# EAGLE design TMS34010 Adapter for DE10 Nano (EAGLE 7.1.0)
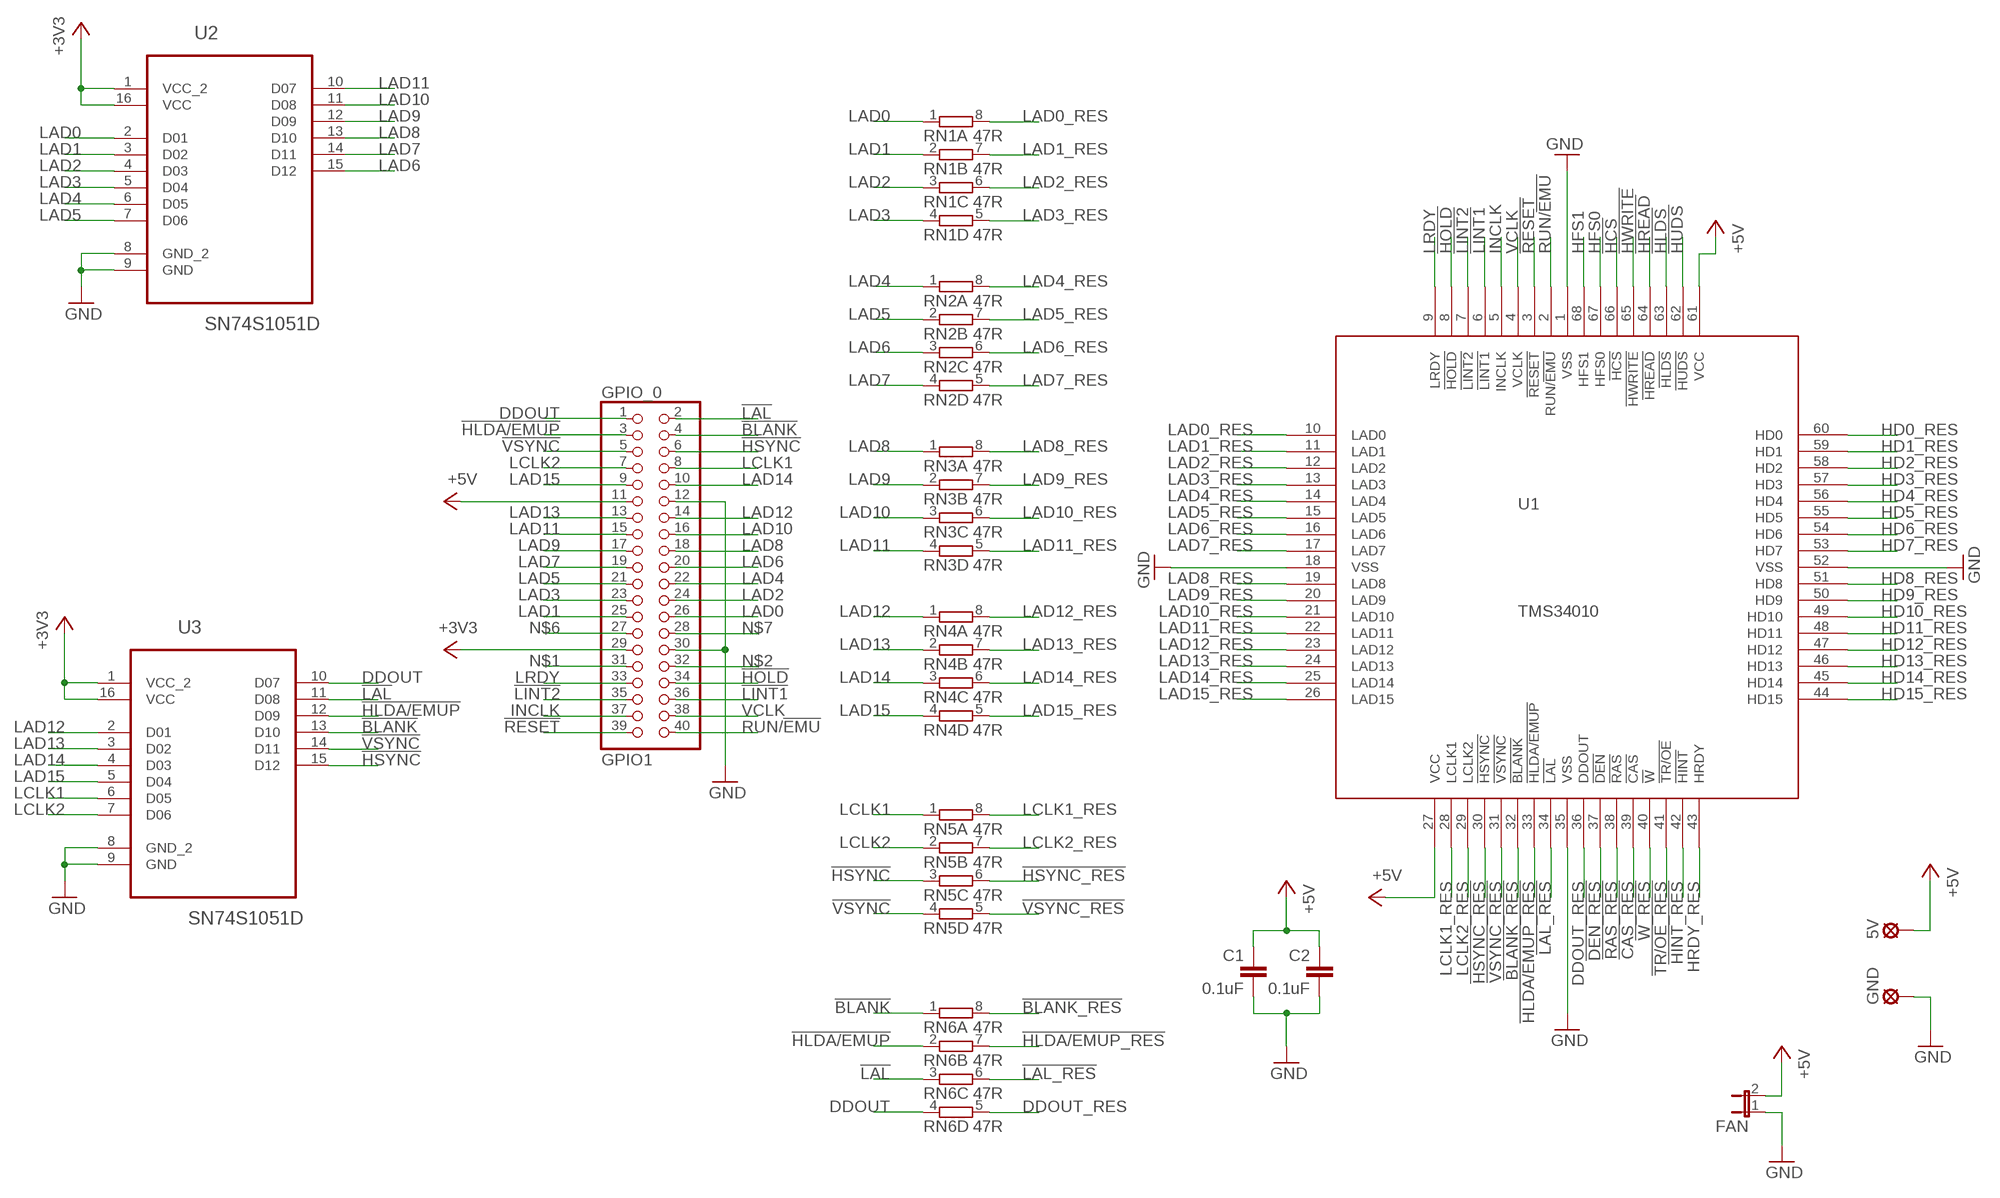
[diagram p0: schematic, sheet 1, part 1 of 2]
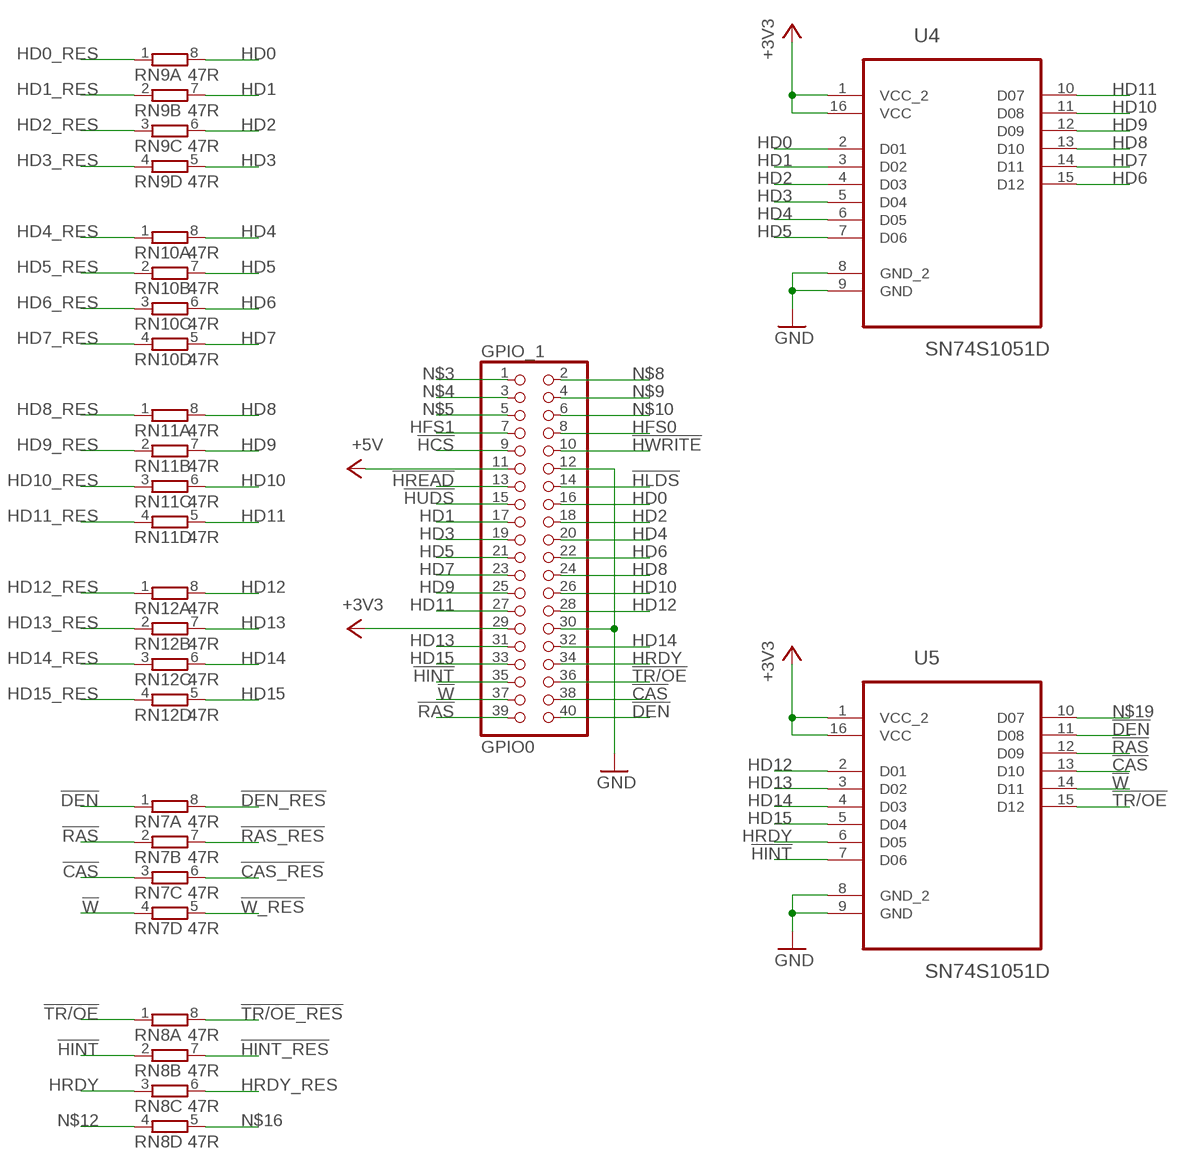
[diagram p1: schematic, sheet 1, part 2 of 2]

## Parts
5V  LSP13  [LSP13]
C1  0.1uF  C-EUC0603  [C0603]
C2  0.1uF  C-EUC0603  [C0603]
FAN  JP1E  [JP1]
GND  LSP13  [LSP13]
GPIO_0  GPIO1  PINHD-2X20  [2X20]
GPIO_1  GPIO0  PINHD-2X20  [2X20]
RN1  47R  4R-NEXBV8V  [EXBV8V]
RN2  47R  4R-NEXBV8V  [EXBV8V]
RN3  47R  4R-NEXBV8V  [EXBV8V]
RN4  47R  4R-NEXBV8V  [EXBV8V]
RN5  47R  4R-NEXBV8V  [EXBV8V]
RN6  47R  4R-NEXBV8V  [EXBV8V]
RN7  47R  4R-NEXBV8V  [EXBV8V]
RN8  47R  4R-NEXBV8V  [EXBV8V]
RN9  47R  4R-NEXBV8V  [EXBV8V]
RN10  47R  4R-NEXBV8V  [EXBV8V]
RN11  47R  4R-NEXBV8V  [EXBV8V]
RN12  47R  4R-NEXBV8V  [EXBV8V]
U1  TMS34010  [PLCC68]
U2  SN74S1051D  [SOIC127P600X175-16N]
U3  SN74S1051D  [SOIC127P600X175-16N]
U4  SN74S1051D  [SOIC127P600X175-16N]
U5  SN74S1051D  [SOIC127P600X175-16N]

## Nets
!BLANK: GPIO_0.4 RN6.1 U3.13(D10)
!BLANK_RES: RN6.8 U1.32(!BLANK)
!CAS: GPIO_1.38 RN7.3 U5.13(D10)
!CAS_RES: RN7.6 U1.39(!CAS)
!DEN: GPIO_1.40 RN7.1 U5.11(D08)
!DEN_RES: RN7.8 U1.37(!DEN)
!HCS: GPIO_1.9 U1.66(!HCS)
!HINT: GPIO_1.35 RN8.2 U5.7(D06)
!HINT_RES: RN8.7 U1.42(!HINT)
!HLDA/EMUP: GPIO_0.3 RN6.2 U3.12(D09)
!HLDA/EMUP_RES: RN6.7 U1.33(!HLDA/EMUP)
!HLDS: GPIO_1.14 U1.63(!HLDS)
!HOLD: GPIO_0.34 U1.8(!HOLD)
!HREAD: GPIO_1.13 U1.64(!HREAD)
!HSYNC: GPIO_0.6 RN5.3 U3.15(D12)
!HSYNC_RES: RN5.6 U1.30(!HSYNC)
!HUDS: GPIO_1.15 U1.62(!HUDS)
!HWRITE: GPIO_1.10 U1.65(!HWRITE)
!LAL: GPIO_0.2 RN6.3 U3.11(D08)
!LAL_RES: RN6.6 U1.34(!LAL)
!LINT1: GPIO_0.36 U1.6(!LINT1)
!LINT2: GPIO_0.35 U1.7(!LINT2)
!RAS: GPIO_1.39 RN7.2 U5.12(D09)
!RAS_RES: RN7.7 U1.38(!RAS)
!RESET: GPIO_0.39 U1.3(!RESET)
!TR/OE: GPIO_1.36 RN8.1 U5.15(D12)
!TR/OE_RES: RN8.8 U1.41(!TR/OE)
!VSYNC: GPIO_0.5 RN5.4 U3.14(D11)
!VSYNC_RES: RN5.5 U1.31(!VSYNC)
!W: GPIO_1.37 RN7.4 U5.14(D11)
!W_RES: RN7.5 U1.40(!W)
+3V3: GPIO_0.29 GPIO_1.29 U2.1(VCC_2) U2.16(VCC) U3.1(VCC_2) U3.16(VCC) U4.1(VCC_2) U4.16(VCC) U5.1(VCC_2) U5.16(VCC)
+5V: 5V.MP C1.1 C2.1 FAN.2 GPIO_0.11 GPIO_1.11 U1.27(VCC) U1.61(VCC)
DDOUT: GPIO_0.1 RN6.4 U3.10(D07)
DDOUT_RES: RN6.5 U1.36(DDOUT)
GND: C1.2 C2.2 FAN.1 GND.MP GPIO_0.12 GPIO_0.30 GPIO_1.12 GPIO_1.30 U1.1(VSS) U1.18(VSS) U1.35(VSS) U1.52(VSS) U2.8(GND_2) U2.9(GND) U3.8(GND_2) U3.9(GND) U4.8(GND_2) U4.9(GND) U5.8(GND_2) U5.9(GND)
HD0: GPIO_1.16 RN9.8 U4.2(D01)
HD0_RES: RN9.1 U1.60(HD0)
HD1: GPIO_1.17 RN9.7 U4.3(D02)
HD1_RES: RN9.2 U1.59(HD1)
HD2: GPIO_1.18 RN9.6 U4.4(D03)
HD2_RES: RN9.3 U1.58(HD2)
HD3: GPIO_1.19 RN9.5 U4.5(D04)
HD3_RES: RN9.4 U1.57(HD3)
HD4: GPIO_1.20 RN10.8 U4.6(D05)
HD4_RES: RN10.1 U1.56(HD4)
HD5: GPIO_1.21 RN10.7 U4.7(D06)
HD5_RES: RN10.2 U1.55(HD5)
HD6: GPIO_1.22 RN10.6 U4.15(D12)
HD6_RES: RN10.3 U1.54(HD6)
HD7: GPIO_1.23 RN10.5 U4.14(D11)
HD7_RES: RN10.4 U1.53(HD7)
HD8: GPIO_1.24 RN11.8 U4.13(D10)
HD8_RES: RN11.1 U1.51(HD8)
HD9: GPIO_1.25 RN11.7 U4.12(D09)
HD9_RES: RN11.2 U1.50(HD9)
HD10: GPIO_1.26 RN11.6 U4.11(D08)
HD10_RES: RN11.3 U1.49(HD10)
HD11: GPIO_1.27 RN11.5 U4.10(D07)
HD11_RES: RN11.4 U1.48(HD11)
HD12: GPIO_1.28 RN12.8 U5.2(D01)
HD12_RES: RN12.1 U1.47(HD12)
HD13: GPIO_1.31 RN12.7 U5.3(D02)
HD13_RES: RN12.2 U1.46(HD13)
HD14: GPIO_1.32 RN12.6 U5.4(D03)
HD14_RES: RN12.3 U1.45(HD14)
HD15: GPIO_1.33 RN12.5 U5.5(D04)
HD15_RES: RN12.4 U1.44(HD15)
HFS0: GPIO_1.8 U1.67(HFS0)
HFS1: GPIO_1.7 U1.68(HFS1)
HRDY: GPIO_1.34 RN8.3 U5.6(D05)
HRDY_RES: RN8.6 U1.43(HRDY)
INCLK: GPIO_0.37 U1.5(INCLK)
LAD0: GPIO_0.26 RN1.1 U2.2(D01)
LAD0_RES: RN1.8 U1.10(LAD0)
LAD1: GPIO_0.25 RN1.2 U2.3(D02)
LAD1_RES: RN1.7 U1.11(LAD1)
LAD2: GPIO_0.24 RN1.3 U2.4(D03)
LAD2_RES: RN1.6 U1.12(LAD2)
LAD3: GPIO_0.23 RN1.4 U2.5(D04)
LAD3_RES: RN1.5 U1.13(LAD3)
LAD4: GPIO_0.22 RN2.1 U2.6(D05)
LAD4_RES: RN2.8 U1.14(LAD4)
LAD5: GPIO_0.21 RN2.2 U2.7(D06)
LAD5_RES: RN2.7 U1.15(LAD5)
LAD6: GPIO_0.20 RN2.3 U2.15(D12)
LAD6_RES: RN2.6 U1.16(LAD6)
LAD7: GPIO_0.19 RN2.4 U2.14(D11)
LAD7_RES: RN2.5 U1.17(LAD7)
LAD8: GPIO_0.18 RN3.1 U2.13(D10)
LAD8_RES: RN3.8 U1.19(LAD8)
LAD9: GPIO_0.17 RN3.2 U2.12(D09)
LAD9_RES: RN3.7 U1.20(LAD9)
LAD10: GPIO_0.16 RN3.3 U2.11(D08)
LAD10_RES: RN3.6 U1.21(LAD10)
LAD11: GPIO_0.15 RN3.4 U2.10(D07)
LAD11_RES: RN3.5 U1.22(LAD11)
LAD12: GPIO_0.14 RN4.1 U3.2(D01)
LAD12_RES: RN4.8 U1.23(LAD12)
LAD13: GPIO_0.13 RN4.2 U3.3(D02)
LAD13_RES: RN4.7 U1.24(LAD13)
LAD14: GPIO_0.10 RN4.3 U3.4(D03)
LAD14_RES: RN4.6 U1.25(LAD14)
LAD15: GPIO_0.9 RN4.4 U3.5(D04)
LAD15_RES: RN4.5 U1.26(LAD15)
LCLK1: GPIO_0.8 RN5.1 U3.6(D05)
LCLK1_RES: RN5.8 U1.28(LCLK1)
LCLK2: GPIO_0.7 RN5.2 U3.7(D06)
LCLK2_RES: RN5.7 U1.29(LCLK2)
LRDY: GPIO_0.33 U1.9(LRDY)
N$1: GPIO_0.31
N$2: GPIO_0.32
N$3: GPIO_1.1
N$4: GPIO_1.3
N$5: GPIO_1.5
N$6: GPIO_0.27
N$7: GPIO_0.28
N$8: GPIO_1.2
N$9: GPIO_1.4
N$10: GPIO_1.6
N$12: RN8.4
N$16: RN8.5
N$19: U5.10(D07)
RUN/!EMU: GPIO_0.40 U1.2(RUN/!EMU)
VCLK: GPIO_0.38 U1.4(VCLK)

## Library data of the parts
5V GND = solpad:LSP13: SOLDER PAD drill 1.3 mm, distributor Buerklin, 12H562
C1 C2 = rcl:C-EU: CAPACITOR, European symbol
FAN = jumper:JP1E: JUMPER
GPIO_0 GPIO_1 = pinhead:PINHD-2X20: PIN HEADER
RN1-RN12 = resistor-dil:4R-N: Array Chip Resistor Source: RS Component / Phycomp; OC_FARNELL: unknown; OC_NEWARK: unknown
U1 = Nintendo-64:TMS34010
U2-U5 = Texas Instruments_By_element14_Batch_1:SN74S1051D: 12-BIT SCHOTTKY BARRIER DIODE BUS-TERMINATION ARRAY; MPN: SN74S1051D; OC_FARNELL: -; OC_NEWARK: 52F2681; PACKAGE: SOIC-16; SUPPLIER: Texas Instruments

## Board
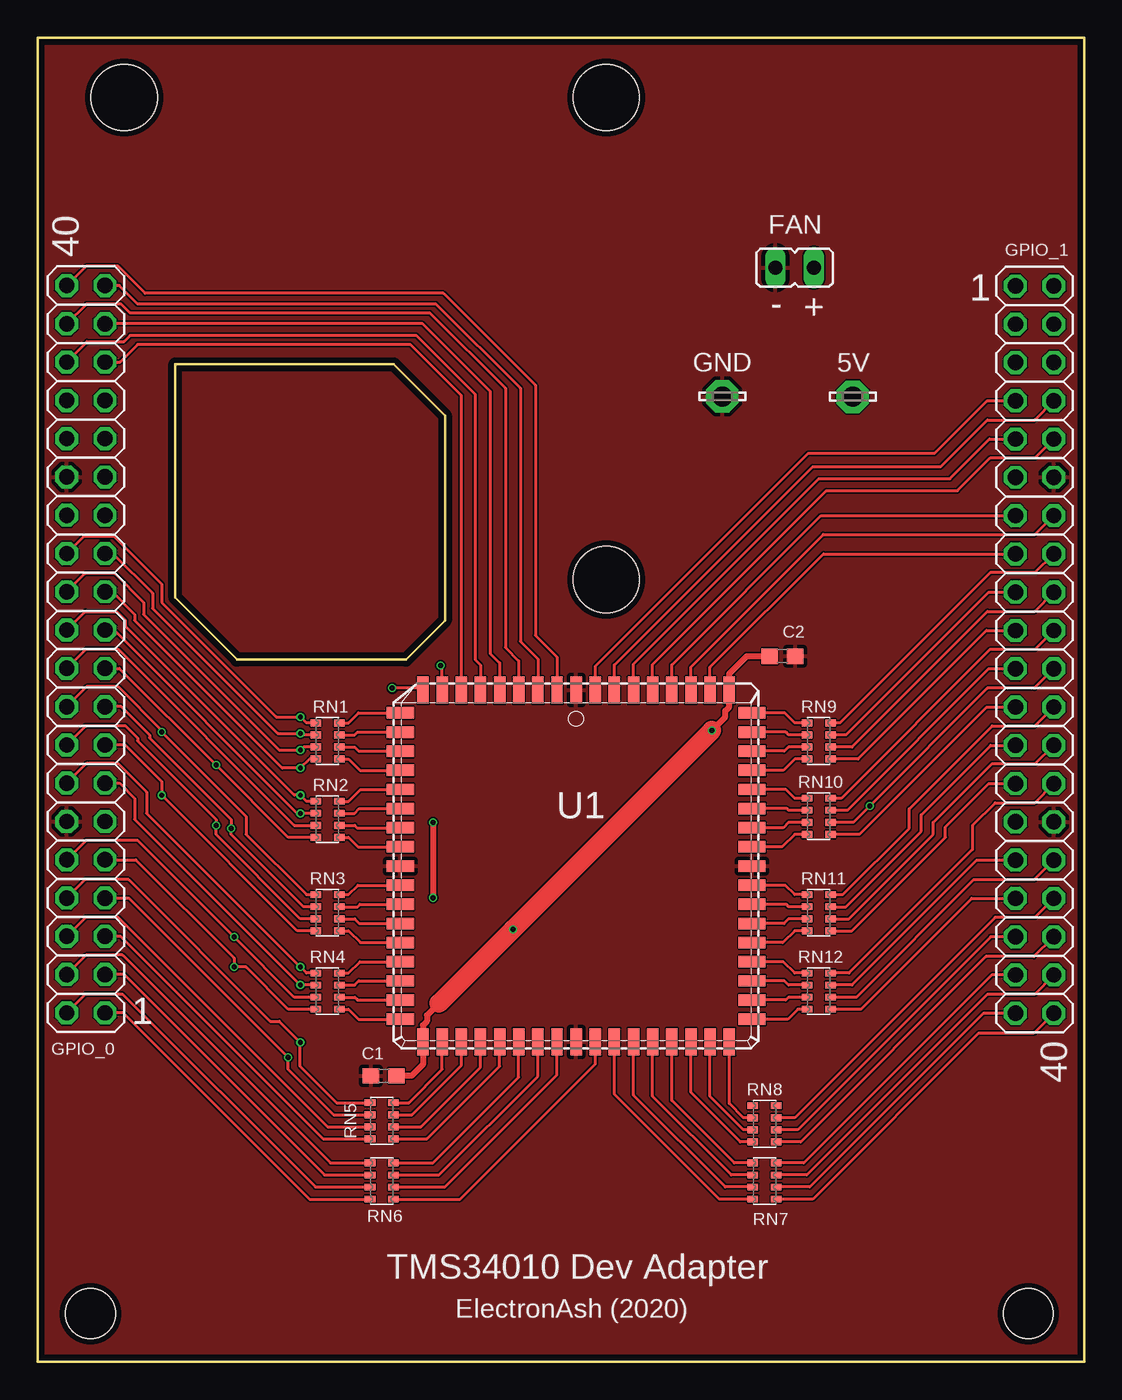
[diagram p2: board, top side]
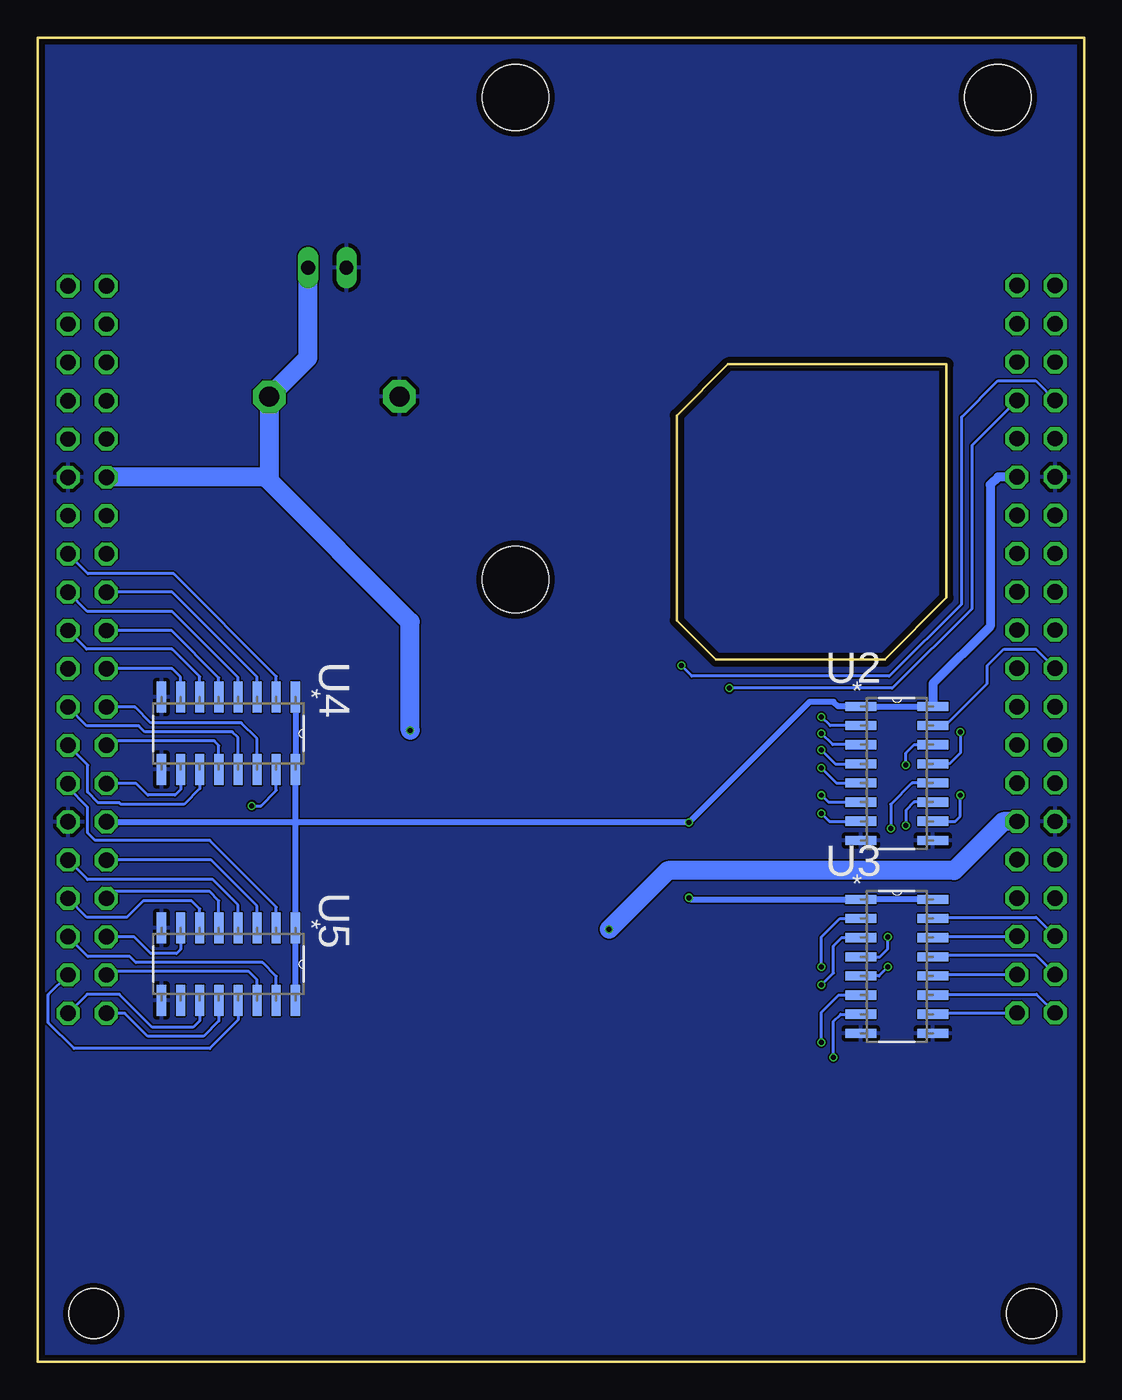
[diagram p3: board, bottom side, seen from below]

Size 69.44 x 87.86 mm. Coordinates in mm from the lower left corner, seen from the top.
Outline: 0,87.86 69.44,87.86 69.44,0 0,0 0,87.86
Outline: 9.13,66.2 23.63,66.2 27.03,62.8 27.03,49.2 24.43,46.6 13.23,46.6 9.13,50.7 9.13,66.2
Copper layers (1+16): Top 0.65mm / dielectric 0.3mm / Bottom 0.65mm
Design rules "default *": minimum track width 4mil, minimum drill 12mil, track to track 4mil, track to pad 4mil, pad to pad 4mil, via to via 4mil, smd to smd 0mil, copper to edge 15mil, drill to drill 15mil, minimum pad ring 8mil, minimum via ring 4mil, stop-mask expansion 6mil, vias tented up to drill 0mil, thermal gap 10mil
Holes 3.3 mm at 3.5,3.2 65.73,3.2
Holes 4.4 mm at 5.73,83.9 37.73,83.9 37.73,51.9
Milling: area 9.1,46.6 to 27,66.2

### Footprints (pad centres in the part's own frame; a part is rotated, then mirrored left to right if it is on the bottom)
LSP13 = drill 1.321 pad 2.159 octagon: MP 0,0
C0603 = smd 1.1 x 1: 1 -0.85,0; 2 0.85,0
JP1 = drill 0.914 long: 1 0,-1.27; 2 0,1.27
2X20 = drill 1.016 octagon: 1 -24.13,-1.27; 2 -24.13,1.27; 3 -21.59,-1.27; 4 -21.59,1.27; 5 -19.05,-1.27; 6 -19.05,1.27; 7 -16.51,-1.27; 8 -16.51,1.27; 9 -13.97,-1.27; 10 -13.97,1.27; 11 -11.43,-1.27; 12 -11.43,1.27; 13 -8.89,-1.27; 14 -8.89,1.27; 15 -6.35,-1.27; 16 -6.35,1.27; 17 -3.81,-1.27; 18 -3.81,1.27; 19 -1.27,-1.27; 20 -1.27,1.27; 21 1.27,-1.27; 22 1.27,1.27; 23 3.81,-1.27; 24 3.81,1.27; 25 6.35,-1.27; 26 6.35,1.27; 27 8.89,-1.27; 28 8.89,1.27; 29 11.43,-1.27; 30 11.43,1.27; 31 13.97,-1.27; 32 13.97,1.27; 33 16.51,-1.27; 34 16.51,1.27; 35 19.05,-1.27; 36 19.05,1.27; 37 21.59,-1.27; 38 21.59,1.27; 39 24.13,-1.27; 40 24.13,1.27
EXBV8V = smd 0.45 x 0.7: 1 -1.2,-0.775; 2 -0.4,-0.775; 3 0.4,-0.775; 4 1.2,-0.775; 5 1.2,0.775; 6 0.4,0.775; 7 -0.4,0.775; 8 -1.2,0.775
PLCC68 = smd 0.76 x 1.8: 1 0,11.67; 2 -1.27,11.67; 3 -2.54,11.67; 4 -3.81,11.67; 5 -5.08,11.67; 6 -6.35,11.67; 7 -7.62,11.67; 8 -8.89,11.67; 9 -10.16,11.67; 27 -10.16,-11.67; 28 -8.89,-11.67; 29 -7.62,-11.67; 30 -6.35,-11.67; 31 -5.08,-11.67; 32 -3.81,-11.67; 33 -2.54,-11.67; 34 -1.27,-11.67; 35 0,-11.67; 36 1.27,-11.67; 37 2.54,-11.67; 38 3.81,-11.67; 39 5.08,-11.67; 40 6.35,-11.67; 41 7.62,-11.67; 42 8.89,-11.67; 43 10.16,-11.67; 61 10.16,11.67; 62 8.89,11.67; 63 7.62,11.67; 64 6.35,11.67; 65 5.08,11.67; 66 3.81,11.67; 67 2.54,11.67; 68 1.27,11.67 | smd 1.8 x 0.76: 10 -11.67,10.16; 11 -11.67,8.89; 12 -11.67,7.62; 13 -11.67,6.35; 14 -11.67,5.08; 15 -11.67,3.81; 16 -11.67,2.54; 17 -11.67,1.27; 18 -11.67,0; 19 -11.67,-1.27; 20 -11.67,-2.54; 21 -11.67,-3.81; 22 -11.67,-5.08; 23 -11.67,-6.35; 24 -11.67,-7.62; 25 -11.67,-8.89; 26 -11.67,-10.16; 44 11.67,-10.16; 45 11.67,-8.89; 46 11.67,-7.62; 47 11.67,-6.35; 48 11.67,-5.08; 49 11.67,-3.81; 50 11.67,-2.54; 51 11.67,-1.27; 52 11.67,0; 53 11.67,1.27; 54 11.67,2.54; 55 11.67,3.81; 56 11.67,5.08; 57 11.67,6.35; 58 11.67,7.62; 59 11.67,8.89; 60 11.67,10.16
SOIC127P600X175-16N = smd 2.057 x 0.61: 1 -4.801,8.89; 2 -4.801,7.62; 3 -4.801,6.35; 4 -4.801,5.08; 5 -4.801,3.81; 6 -4.801,2.54; 7 -4.801,1.27; 8 -4.801,0; 9 0,0; 10 0,1.27; 11 0,2.54; 12 0,3.81; 13 0,5.08; 14 0,6.35; 15 0,7.62; 16 0,8.89

### Placement (x,y rotation side)
5V  54.08,64.04 0 top
C1  22.96,18.99 180 top
C2  49.43,46.82 0 top
FAN  50.23,72.6 270 top
GND  45.44,64.06 0 top
GPIO_0  3.19,47.28 90 top
GPIO_1  66.16,47.26 270 top
RN1  19.23,41.2 270 top
RN2  19.23,36 270 top
RN3  19.23,29.8 270 top
RN4  19.23,24.6 270 top
RN5  22.83,16 270 top
RN6  22.83,12 270 top
RN7  48.23,12 90 top
RN8  48.23,15.8 90 top
RN9  51.83,41.2 270 top
RN10  51.83,36.2 270 top
RN11  51.83,29.8 270 top
RN12  51.83,24.6 270 top
U1  35.73,32.9 0 top
U2  10.03,34.6 0 bottom
U3  10.03,21.8 0 bottom
U4  61.23,39.3 270 bottom
U5  61.23,24 270 bottom

### Tracks (layer width: path | path; a pad name or v marks a point on that pad's centre or on a via)
!BLANK
  Top 0.203: GPIO_0.4 3.23,27 5.63,27 19.43,13.2 RN6.1
  Bottom 0.203: U3.13 9.91,27 3.23,27 GPIO_0.4
!BLANK_RES
  Top 0.203: RN6.8 26.23,13.2 31.92,18.89 U1.32
!CAS
  Top 0.203: GPIO_1.38 66.16,24.4 63.03,24.4 51.03,12.4 RN7.3
  Bottom 0.203: U5.13 56.15,22.68 58.03,20.8 67.03,20.8 68.73,22.5 68.73,24.37 GPIO_1.38
!CAS_RES
  Top 0.203: RN7.6 46.03,12.4 40.81,17.62 U1.39
!DEN
  Top 0.203: GPIO_1.40 66.1,21.8 62.43,21.8 51.43,10.8 RN7.1
  Bottom 0.203: U5.11 58.69,22.64 59.13,22.2 61.83,22.2 64.03,24.4 66.16,24.4 GPIO_1.40
!DEN_RES
  Top 0.203: RN7.8 45.23,10.8 38.27,17.76 U1.37
!HCS
  Top 0.203: GPIO_1.9 63.16,61.23 60.53,58.6 51.83,58.6 39.54,46.31 U1.66
!HINT
  Top 0.203: GPIO_1.35 63.24,28.21 50.43,15.4 RN8.2
  Bottom 0.203: U5.7 59.96,27.37 60.23,27.1 61.93,27.1 63.04,28.21 GPIO_1.35
!HINT_RES
  Top 0.203: RN8.7 46.83,15.4 44.62,17.61 U1.42
!HLDA/EMUP
  Top 0.203: GPIO_0.3 5.73,25.69 19.03,12.4 RN6.2
  Bottom 0.203: U3.12 9.94,25.69 GPIO_0.3
!HLDA/EMUP_RES
  Top 0.203: RN6.7 26.63,12.4 33.19,18.96 U1.33
!HLDS
  Top 0.203: GPIO_1.14 66.18,54.9 52.13,54.9 43.35,46.12 U1.63
!HOLD  (via drill 0.33)
  Top 0.203: U1.8 26.84,46.09 v26.73,46.2
  Bottom 0.203: v26.73,46.2 26.03,45.5 12.93,45.5 8.13,50.3 8.13,62.7 5.73,65.1 3.23,65.1 GPIO_0.34
!HREAD
  Top 0.203: U1.64 42.08,46.25 51.98,56.15 GPIO_1.13
!HSYNC
  Top 0.203: GPIO_0.6 3.19,29.5 5.33,29.5 19.23,15.6 RN5.3
  Bottom 0.203: U3.15 9.95,29.5 3.19,29.5 GPIO_0.6
!HSYNC_RES
  Top 0.203: RN5.6 25.43,15.6 29.38,19.55 U1.30
!HUDS
  Top 0.203: U1.62 44.62,46.09 52.14,53.61 GPIO_1.15
!HWRITE
  Top 0.203: GPIO_1.10 66.2,60 63.23,60 61.03,57.8 52.33,57.8 40.81,46.28 U1.65
!LAL
  Top 0.203: GPIO_0.2 3.17,24.4 5.63,24.4 18.43,11.6 RN6.3
  Bottom 0.203: U3.11 9.97,24.4 3.17,24.4 GPIO_0.2
!LAL_RES
  Top 0.203: RN6.6 27.03,11.6 34.46,19.03 U1.34
!LINT1
  Top 0.203: GPIO_0.36 3.29,67.7 5.73,67.7 6.13,68.1 25.13,68.1 29.03,64.2 29.03,46.6 29.38,46.25 U1.6
!LINT2
  Top 0.203: GPIO_0.35 5.47,66.33 6.63,67.5 24.73,67.5 28.11,64.12 U1.7
!RAS
  Top 0.203: GPIO_1.39 62.76,23.13 51.23,11.6 RN7.2
  Bottom 0.203: U5.12 57.42,22.61 58.43,21.6 62.13,21.6 63.66,23.13 GPIO_1.39
!RAS_RES
  Top 0.203: RN7.7 45.63,11.6 39.54,17.69 U1.38
!RESET
  Top 0.203: GPIO_0.39 5.41,71.41 6.63,70.2 26.43,70.2 32.03,64.6 32.03,47.8 33.19,46.64 U1.3
!TR/OE
  Top 0.203: GPIO_1.36 66.12,26.9 62.93,26.9 50.63,14.6 RN8.1
  Bottom 0.203: U5.15 53.61,25.58 54.53,26.5 62.93,26.5 63.33,26.9 66.12,26.9 GPIO_1.36
!TR/OE_RES
  Top 0.203: RN8.8 46.63,14.6 43.35,17.88 U1.41
!VSYNC
  Top 0.203: GPIO_0.5 5.49,28.23 18.93,14.8 RN5.4
  Bottom 0.203: U3.14 9.94,28.23 GPIO_0.5
!VSYNC_RES
  Top 0.203: RN5.5 25.83,14.8 30.65,19.62 U1.31
!W
  Top 0.203: GPIO_1.37 63.3,25.67 50.83,13.2 RN7.4
  Bottom 0.203: U5.14 54.88,25.35 55.43,25.9 64.66,25.9 GPIO_1.37
!W_RES
  Top 0.203: RN7.5 46.23,13.2 42.08,17.35 U1.40
+3V3  (via drill 0.33)
  Top 0.406: v26.23,35.8 v26.23,30.8
  Bottom 0.406: U2.16 U2.1 16.32,43.49 16.63,43.8 18.23,43.8 v26.23,35.8 26.26,35.83 52.33,35.83 | v26.23,30.8 26.12,30.69 U3.1 U3.16 | U5.16 U5.1 52.34,35.82 | GPIO_1.29 52.33,35.83 | 52.34,35.82 52.33,35.83 | U4.1 U4.16 52.34,35.82
  Bottom 0.61: GPIO_0.29 5.71,58.71 6.23,58.2 6.23,48.8 10.03,45 U2.16
+5V  (via drill 0.33)
  Top 0.406: C2.1 47.05,46.82 45.89,45.66 U1.61 45.89,43.46 45.63,43.2 45.63,42.8 v44.73,41.9 | C1.1 24.82,18.99 25.57,19.74 U1.27 25.57,22.34 25.83,22.6 25.83,23 26.63,23.8
  Top 1.27: 26.63,23.8 v31.53,28.7 v44.73,41.9
  Bottom 1.27: GPIO_0.11 5.37,35.85 8.63,32.6 27.63,32.6 v31.53,28.7 | FAN.2 51.5,66.62 5V.MP 54.08,58.75 54.23,58.6 | v44.73,41.9 44.73,49.1 54.23,58.6 | 54.23,58.6 54.32,58.69 GPIO_1.11
DDOUT
  Top 0.203: GPIO_0.1 5.67,23.15 18.03,10.8 RN6.4
  Bottom 0.203: U3.10 9.94,23.15 GPIO_0.1
DDOUT_RES
  Top 0.203: RN6.5 28.03,10.8 37,19.77 U1.36
GND
  pour Top (rank 2): 0,87.86 69.44,87.86 69.44,0 0,0
  pour Bottom: 0,87.86 69.44,87.86 69.44,0 0,0
HD0
  Top 0.203: GPIO_1.16 66.22,52.4 63.24,52.4 53.24,42.4 RN9.8
  Bottom 0.203: GPIO_1.16 66.12,52.3 60.43,52.3 53.61,45.48 U4.2
HD0_RES
  Top 0.203: RN9.1 50.23,42.4 49.57,43.06 U1.60
HD1
  Top 0.203: GPIO_1.17 63.1,51.07 53.63,41.6 RN9.7
  Bottom 0.203: U4.3 54.88,45.45 60.5,51.07 GPIO_1.17
HD1_RES
  Top 0.203: RN9.2 49.83,41.6 49.64,41.79 U1.59
HD2
  Top 0.203: GPIO_1.18 66.16,49.8 63.03,49.8 54.03,40.8 RN9.6
  Bottom 0.203: GPIO_1.18 66.16,49.8 60.53,49.8 56.15,45.42 U4.4
HD2_RES
  Top 0.203: RN9.3 49.83,40.8 49.55,40.52 U1.58
HD3
  Top 0.203: GPIO_1.19 62.96,48.53 54.43,40 RN9.5
  Bottom 0.203: 57.42,44.91 U4.5 57.42,45.39 60.56,48.53 GPIO_1.19
HD3_RES
  Top 0.203: RN9.4 50.23,40 49.48,39.25 U1.57
HD4
  Top 0.203: GPIO_1.20 66.2,47.3 63.23,47.3 53.33,37.4 RN10.8
  Bottom 0.203: U4.6 58.69,45.46 60.53,47.3 66.2,47.3 GPIO_1.20
HD4_RES
  Top 0.203: RN10.1 50.23,37.4 49.65,37.98 U1.56
HD5
  Top 0.203: GPIO_1.21 63.12,45.99 53.73,36.6 RN10.7
  Bottom 0.203: U4.7 59.96,45.43 60.52,45.99 GPIO_1.21
HD5_RES
  Top 0.203: RN10.2 49.83,36.6 49.72,36.71 U1.55
HD6  (via drill 0.33)
  Top 0.203: GPIO_1.22 66.14,44.7 63.03,44.7 v55.23,36.9 54.13,35.8 RN10.6
  Bottom 0.203: v55.23,36.9 54.63,36.9 53.61,37.92 U4.15
HD6_RES
  Top 0.203: RN10.3 49.83,35.8 49.47,35.44 U1.54
HD7
  Top 0.203: GPIO_1.23 62.98,43.45 54.53,35 RN10.5
  Bottom 0.203: U4.14 54.88,41.35 55.93,42.4 61.93,42.4 62.98,43.45 GPIO_1.23
HD7_RES
  Top 0.203: RN10.4 50.23,35 49.4,34.17 U1.53
HD8
  Top 0.203: GPIO_1.24 66.18,42.2 63.33,42.2 57.83,36.7 57.83,35.4 53.43,31 RN11.8
  Bottom 0.203: U4.13 56.15,41.42 56.53,41.8 62.33,41.8 62.73,42.2 66.18,42.2 GPIO_1.24
HD8_RES
  Top 0.203: RN11.1 50.23,31 49.6,31.63 U1.51
HD9
  Top 0.203: GPIO_1.25 63.24,40.91 58.63,36.3 58.63,35.2 53.63,30.2 RN11.7
  Bottom 0.203: U4.12 57.42,40.89 57.73,41.2 64.6,41.2 GPIO_1.25
HD9_RES
  Top 0.203: RN11.2 49.83,30.2 49.67,30.36 U1.50
HD10
  Top 0.203: GPIO_1.26 66.22,39.7 63.33,39.7 59.43,35.8 59.43,35 53.83,29.4 RN11.6
  Bottom 0.203: GPIO_1.26 66.12,39.6 66.13,39.58 66.13,37.8 65.43,37.1 64.03,37.1 63.93,37 59.73,37 58.69,38.04 U4.11
HD10_RES
  Top 0.203: RN11.3 49.83,29.4 49.52,29.09 U1.49
HD11
  Top 0.203: GPIO_1.27 63.1,38.37 60.23,35.5 60.23,34.8 54.03,28.6 RN11.5
  Bottom 0.203: U4.10 59.96,37.97 60.33,37.6 62.13,37.6 62.9,38.37 GPIO_1.27
HD11_RES
  Top 0.203: RN11.4 50.23,28.6 49.45,27.82 U1.48
HD12
  Top 0.203: GPIO_1.28 66.16,37.1 63.53,37.1 62.03,35.6 62.03,34 53.83,25.8 RN12.8
  Bottom 0.203: U5.2 53.61,30.18 58.03,34.6 65.63,34.6 66.13,35.1 66.13,36.8 67.43,38.09 GPIO_1.28
HD12_RES
  Top 0.203: RN12.1 50.23,25.8 49.48,26.55 U1.47
HD13
  Top 0.203: RN12.7 54.03,25 62.32,33.29 GPIO_1.31
  Bottom 0.203: U5.3 54.88,30.25 57.92,33.29 GPIO_1.31
HD13_RES
  Top 0.203: RN12.2 49.83,25 49.55,25.28 U1.46
HD14
  Top 0.203: GPIO_1.32 66.14,32 62.13,32 54.33,24.2 RN12.6
  Bottom 0.203: U5.4 56.15,30.32 57.83,32 66.14,32 GPIO_1.32
HD14_RES
  Top 0.203: RN12.3 49.83,24.2 49.64,24.01 U1.45
HD15
  Top 0.203: GPIO_1.33 61.98,30.75 54.63,23.4 RN12.5
  Bottom 0.203: U5.5 57.42,30.59 58.03,31.2 64.44,31.2 GPIO_1.33
HD15_RES
  Top 0.203: RN12.4 50.43,23.4 49.77,22.74 U1.44
HFS0
  Top 0.203: GPIO_1.8 66.16,62.5 63.03,62.5 59.93,59.4 51.43,59.4 38.27,46.24 U1.67
HFS1
  Top 0.203: GPIO_1.7 63,63.77 59.53,60.3 51.13,60.3 37,46.17 U1.68
HRDY
  Top 0.203: GPIO_1.34 66.18,29.5 63.53,29.5 50.23,16.2 RN8.3
  Bottom 0.203: U5.6 58.69,30.06 59.23,30.6 62.43,30.6 63.53,29.5 66.18,29.5 GPIO_1.34
HRDY_RES
  Top 0.203: RN8.6 46.83,16.2 45.89,17.14 U1.43
INCLK
  Top 0.203: GPIO_0.37 25.55,68.87 30.03,64.4 30.03,47 30.65,46.38 U1.5
LAD0  (via drill 0.33)
  Top 0.203: RN1.1 17.83,42.4 v17.43,42.8 15.83,42.8 8.23,50.4 8.23,51.6 5.03,54.8 3.09,54.8 GPIO_0.26
  Bottom 0.203: U2.2 16.85,42.22 v17.43,42.8
LAD0_RES
  Top 0.203: RN1.8 20.63,42.4 21.29,43.06 U1.10
LAD1  (via drill 0.33)
  Top 0.203: RN1.2 17.53,41.6 v17.43,41.7 15.93,41.7 7.63,50 7.63,51 4.99,53.63 GPIO_0.25
  Bottom 0.203: 14.08,40.95 U2.3 16.68,40.95 v17.43,41.7
LAD1_RES
  Top 0.203: RN1.7 21.03,41.6 21.22,41.79 U1.11
LAD2  (via drill 0.33)
  Top 0.203: GPIO_0.24 3.13,52.3 5.13,52.3 7.03,50.4 7.03,49.6 16.03,40.6 v17.43,40.6 | RN1.3 17.63,40.8 v17.43,40.6 | 17.33,40.6 v17.43,40.6
  Bottom 0.203: v17.43,40.6 16.51,39.68 U2.4
LAD2_RES
  Top 0.203: RN1.6 21.03,40.8 21.31,40.52 U1.12
LAD3  (via drill 0.33)
  Top 0.203: RN1.4 18.03,40 v17.43,39.4 16.23,39.4 6.43,49.2 6.43,49.6 4.93,51.09 GPIO_0.23
  Bottom 0.203: v17.43,39.4 16.44,38.41 U2.5
LAD3_RES
  Top 0.203: RN1.5 20.63,40 21.38,39.25 U1.13
LAD4  (via drill 0.33)
  Top 0.203: GPIO_0.22 3.17,49.8 5.23,49.8 5.83,49.2 5.83,48.8 17.03,37.6 v17.43,37.6 17.83,37.2 RN2.1
  Bottom 0.203: v17.43,37.6 16.97,37.14 U2.6
LAD4_RES
  Top 0.203: RN2.8 20.63,37.2 21.41,37.98 U1.14
LAD5  (via drill 0.33)
  Top 0.203: RN2.2 v17.43,36.4 17.23,36.4 5.07,48.55 GPIO_0.21
  Bottom 0.203: v17.43,36.4 16.9,35.87 U2.7
LAD5_RES
  Top 0.203: RN2.7 21.03,36.4 21.34,36.71 U1.15
LAD6
  Top 0.203: GPIO_0.20 3.21,47.3 5.33,47.3 17.03,35.6 RN2.3
  Bottom 0.203: U2.15 9.21,42.22 6.43,45 6.43,46.2 5.33,47.3 3.21,47.3 GPIO_0.20
LAD6_RES
  Top 0.203: RN2.6 21.03,35.6 21.19,35.44 U1.16
LAD7  (via drill 0.33)
  Top 0.203: GPIO_0.19 5.41,46.01 v11.83,39.6 16.63,34.8 RN2.4
  Bottom 0.203: v11.83,39.6 11.83,40.4 11.28,40.95 U2.14
LAD7_RES
  Top 0.203: RN2.5 20.63,34.8 21.26,34.17 U1.17
LAD8  (via drill 0.33)
  Top 0.203: GPIO_0.18 3.25,44.8 5.33,44.8 8.23,41.9 v8.23,41.8 13.83,36.2 13.83,35 17.83,31 RN3.1
  Bottom 0.203: v8.23,41.8 8.23,40.4 8.95,39.68 U2.13
LAD8_RES
  Top 0.203: RN3.8 20.63,31 21.26,31.63 U1.19
LAD9  (via drill 0.33)
  Top 0.203: GPIO_0.17 5.55,43.47 7.43,41.6 7.43,41.4 12.83,36 v12.83,35.4 12.83,35 17.63,30.2 RN3.2
  Bottom 0.203: U2.12 11.42,38.41 12.83,37 v12.83,35.4
LAD9_RES
  Top 0.203: RN3.7 21.23,30.2 21.39,30.36 U1.20
LAD10  (via drill 0.33)
  Top 0.203: GPIO_0.16 3.19,42.2 5.83,42.2 6.63,41.4 6.63,41.2 11.83,36 v11.83,35.6 11.83,35 17.43,29.4 RN3.3
  Bottom 0.203: U2.11 11.29,37.14 11.83,36.6 v11.83,35.6
LAD10_RES
  Top 0.203: RN3.6 21.03,29.4 21.34,29.09 U1.21
LAD11  (via drill 0.33)
  Top 0.203: GPIO_0.15 5.79,40.93 8.23,38.5 v8.23,37.6 17.23,28.6 RN3.4
  Bottom 0.203: U2.10 8.56,35.87 8.23,36.2 v8.23,37.6
LAD11_RES
  Top 0.203: RN3.5 20.63,28.6 21.41,27.82 U1.22
LAD12  (via drill 0.33)
  Top 0.203: GPIO_0.14 3.23,39.7 5.33,39.7 7.23,37.8 7.23,36.4 v17.43,26.2 17.83,25.8 RN4.1
  Bottom 0.203: v17.43,26.2 17.43,28.2 16.21,29.42 U3.2
LAD12_RES
  Top 0.203: RN4.8 20.63,25.8 21.38,26.55 U1.23
LAD13  (via drill 0.33)
  Top 0.203: GPIO_0.13 5.43,38.39 6.43,37.4 6.43,36 v17.43,25 RN4.2
  Bottom 0.203: v17.43,25 16.63,25.8 16.63,27.6 16.08,28.15 U3.3
LAD13_RES
  Top 0.203: RN4.7 21.03,25 21.31,25.28 U1.24
LAD14  (via drill 0.33)
  Top 0.203: GPIO_0.10 3.21,34.6 6.63,34.6 v13.03,28.2 17.03,24.2 RN4.3
  Bottom 0.203: U3.4 13.55,26.88 13.03,27.4 v13.03,28.2
LAD14_RES
  Top 0.203: RN4.6 21.03,24.2 21.22,24.01 U1.25
LAD15  (via drill 0.33)
  Top 0.203: GPIO_0.9 6.51,33.31 13.03,26.8 v13.03,26.2 13.83,26.2 16.63,23.4 RN4.4
  Bottom 0.203: v13.03,26.2 13.62,25.61 U3.5
LAD15_RES
  Top 0.203: RN4.5 20.63,23.4 21.29,22.74 U1.26
LCLK1  (via drill 0.33)
  Top 0.203: GPIO_0.8 3.15,32 6.03,32 15.43,22.6 16.03,22.6 v17.43,21.2 17.43,19.6 19.83,17.2 RN5.1
  Bottom 0.203: v17.43,21.2 17.43,23.2 16.29,24.34 U3.6
LCLK1_RES
  Top 0.203: RN5.8 24.63,17.2 26.84,19.41 U1.28
LCLK2  (via drill 0.33)
  Top 0.203: RN5.2 19.63,16.4 16.63,19.4 v16.63,20.2 6.05,30.77 GPIO_0.7
  Bottom 0.203: v16.63,20.2 16.63,22.6 16.16,23.07 U3.7
LCLK2_RES
  Top 0.203: RN5.7 24.83,16.4 28.11,19.68 U1.29
LRDY  (via drill 0.33)
  Top 0.203: U1.9 25.44,44.7 v23.53,44.7
  Bottom 0.203: GPIO_0.33 7.43,60.83 7.43,50 12.73,44.7 v23.53,44.7
RUN/!EMU
  Top 0.203: GPIO_0.40 3.21,72.7 5.33,72.7 7.13,70.9 26.93,70.9 33.03,64.8 33.03,48.2 34.46,46.77 U1.2
VCLK
  Top 0.203: GPIO_0.38 3.25,70.2 5.53,70.2 6.13,69.6 26.03,69.6 31.03,64.6 31.03,47.4 31.92,46.51 U1.4

### Text on the board
tPlace: 40 | 1 | - | + | 1 | 40 | TMS34010 Dev Adapter
tNames: ElectronAsh (2020)